# Altium schematic sheet Valve.SchDoc
size A4
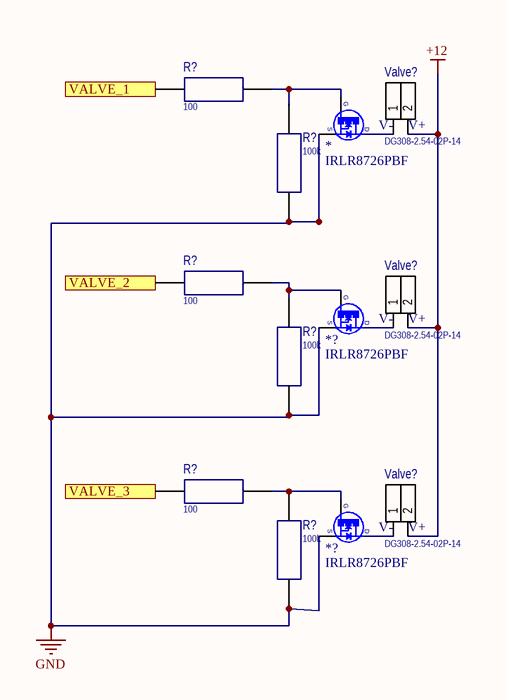
[diagram p0: Valve.SchDoc]

## Parts
(Parts that share a designator on the sheet are numbered #1, #2 ... from top to bottom, then left to right.)
*  IRLR8726PBF  [IRLR8726PBF]
*?#1  IRLR8726PBF  [IRLR8726PBF]
*?#2  IRLR8726PBF  [IRLR8726PBF]
R?#1  100  [R_0805]
R?#2  100k  [R_0805]
R?#3  100  [R_0805]
R?#4  100k  [R_0805]
R?#5  100  [R_0805]
R?#6  100k  [R_0805]
Valve?#1  DG308-2.54-02P-14  [DG308-2.54-02P-14]
Valve?#2  DG308-2.54-02P-14  [DG308-2.54-02P-14]
Valve?#3  DG308-2.54-02P-14  [DG308-2.54-02P-14]

## Ports
VALVE_1, VALVE_2, VALVE_3

## Nets
+12: Valve?#1.2 Valve?#2.2 Valve?#3.2
GND: *.3(S) *?#1.3(S) *?#2.3(S) R?#2.1 R?#4.1 R?#6.1
VALVE_1: R?#1.2 ; port VALVE_1
VALVE_2: R?#3.2 ; port VALVE_2
VALVE_3: R?#5.2 ; port VALVE_3
Net*?#1_2: *?#1.2(G) R?#3.1 R?#4.2
Net*?#2_2: *?#2.2(G) R?#5.1 R?#6.2
Net*_2: *.2(G) R?#1.1 R?#2.2

Not connected (* = marked no-connect by the designer): Valve?#1 1; Valve?#2 1; Valve?#3 1

## Notes on the sheet
- (near Valve?#1) V-
- (near Valve?#1) V+
- (near Valve?#2) V-
- (near Valve?#2) V+
- (near Valve?#3) V-
- (near Valve?#3) V+
- (in symbol IRLR8726PBF) D

## Library data of the parts
R?#1-R?#6 = R0805: Resistor
  R?#1 R?#3 R?#5: Value: 100
  R?#2 R?#4 R?#6: Value: 100k
Valve?#1-Valve?#3 = DG308-2.54-02P-14: Connector 3Pin 2.54 pitch